# Altium schematic sheet Schematic.SchDoc: Muzzleflash Simulator V1
size A4; DrawnBy: Philipp Hergesell; Revision: V1.0; SheetNumber: 1; SheetTotal: 1
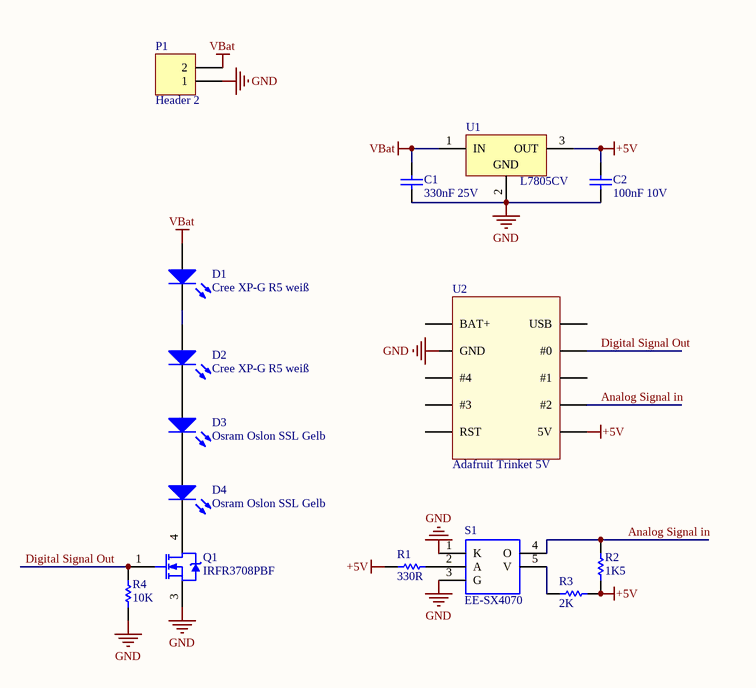
[diagram p0: Schematic.SchDoc]

## Parts
C1  330nF 25V  [CAPC0603(1608)100_M]
C2  100nF 10V  [CAPC0603(1608)100_L]
D1  Cree XP-G R5 weiß  [3.5X2.8X1.9]
D2  Cree XP-G R5 weiß  [3.5X2.8X1.9]
D3  Osram Oslon SSL Gelb  [3.5X2.8X1.9]
D4  Osram Oslon SSL Gelb  [3.5X2.8X1.9]
P1  Header 2  [HDR1X2]
Q1  IRFR3708PBF  [INTR-TO-252AA-3_M]
R1  330R  [RESC0603(1608)_L]
R2  1K5  [RESC0603(1608)_L]
R3  2K  [RESC0603(1608)_N]
R4  10K  [RESC0603(1608)_N]
S1  EE-SX4070  [EE-SX4070]
U1  L7805CV  [TO220]
U2  Adafruit Trinket 5V

## Nets
+5V: C2.2 R1.1 R2.1 R3.2 U1.3(OUT) U2.10(5V)
GND: C1.1 C2.1 P1.1 Q1.3(S) R4.1 S1.1(K) S1.3(G) U1.2(GND)
VBat: C1.2 D1.1(A) P1.2 U1.1(IN)
Analog Signal in: R2.2 S1.4(O) U2.9(#2)
Digital Signal Out: Q1.1(G) R4.2 U2.7(#0)
NetD1_2: D1.2(K) D2.1(A)
NetD2_2: D2.2(K) D3.1(A)
NetD3_2: D3.2(K) D4.1(A)
NetD4_2: D4.2(K) Q1.4(D)
NetR1_2: R1.2 S1.2(A)
NetR3_1: R3.1 S1.5(V)

Not connected (* = marked no-connect by the designer): U2 1(BAT+) 2(GND) 3(#4) 4(#3) 5(RST) 6(USB) 8(#1)

## Notes on the sheet
- Labels drawn without touching a wire or pin: GND

## Library data of the parts
C1 = CMP-1035-02676-1: CAP 330nF 25V -20% to +80% 0603 (1608 Metric) Thickness 1mm SMD; Case-EIA: 0603; Case-Metric: 1608; Max Thickness: 1 mm; Rated Voltage: 25 V; Tolerance: -20% to +80%; Value: 330nF; Technology: SMT
C2 = CMP-1035-02579-1: CAP 100nF 10V ±5% 0603 (1608 Metric) Thickness 1mm SMD; Tolerance: Â±5%; Case-EIA: 0603; Case-Metric: 1608; Value: 100nF; Max Thickness: 1 mm; Rated Voltage: 10 V; Technology: SMT
D1-D4 = LED3: Typical BLUE SiC LED; Published: 8-Jun-2000; LatestRevisionDate: 17-Dec-2003; LatestRevisionNote: PCB Footprint replaced.; DatasheetVersion: 16-Apr-2002; PackageVersion: 16-Apr-2002; PackageReference: 3.5X2.8X1.9; Publisher: Altium Limited; PackageDescription: SM LED; 2 C-Bend Leads; Body 3.5 x 2.8 x 1.9 mm, inc leads (LxWxH typ)
P1 = Header 2: Header, 2-Pin; LatestRevisionDate: 17-Jul-2002; LatestRevisionNote: Re-released for DXP Platform.; Publisher: Altium Limited
Q1 = CMP-2000-05156-1: Mosfet N-Channel, 30 V, 61 A, -55 to 175 degC, 3-Pin DPAK, RoHS, Tube; Manufacturer: International Rectifier; Voltage Vds Typ: 30V; Power Dissipation Pd: 87W; Rds(on) Test Voltage Vgs: 10V; Transistor Polarity: NChannel; Threshold Voltage Vgs Typ: 2V; Pulse Current Idm: 244A; Junction to Case Thermal Resistance A: 1.73degC/W; On Resistance Rds(on): 13mohm; No. of Pins: 3; Alternate Case Style: D-PAK; On State resistance @ Vgs = 10V: 12.5mohm; SVHC: NoSVHC(19-Dec-2012); Continuous Drain Current Id: 61A; Transistor Case Style: TO-252; Package Reference: TO-252AA-3; Drain Source Voltage Vds: 30V; Datasheet URL: http://www.irf.com/product-info/datasheets/data/irfr3708pbf.pdf; Voltage Vgs Rds on Measurement: 10V; Operating Temperature Min: -55degC; MSL: –; Manufacturer URL: http://internationalrectifier.com/; Voltage Vgs Max: 2V; Operating Temperature Range: -55degCto+175degC; Current Id Max: 61A; Operating Temperature Max: 175degC; Package / Case: DPAK; Package Description: 3-Pin Surface Mount Device, Body 6.54 x 6.095 mm, Pitch 2.29 mm; Datasheet Version: Dec-04
R1 = CMP-1012-00062-1: 330R 0.1W 5% 0603 (1608 Metric)  SMD; Value: 330.00 Ohm; Case-EIA: 0603; Case-Metric: 1608; Tolerance: 5 %; Power: 0.1 W; Technology: SMT
R2 = CMP-1012-00528-1: 1K5 0.1W 1% 0603 (1608 Metric)  SMD; Case-EIA: 0603; Value: 1500.00 Ohm; Case-Metric: 1608; Power: 0.1 W; Technology: SMT; Tolerance: 1 %
R3 = CMP-1012-00542-1: 2K 0.1W 1% 0603 (1608 Metric)  SMD; Case-EIA: 0603; Value: 2000.00 Ohm; Case-Metric: 1608; Power: 0.1 W; Technology: SMT; Tolerance: 1 %
R4 = CMP-1012-00623-1: 10K 0.1W 1% 0603 (1608 Metric)  SMD; Value: 10000.00 Ohm; Case-EIA: 0603; Case-Metric: 1608; Power: 0.1 W; Tolerance: 1 %; Technology: SMT
S1 = EE-SX4070: Slotted photo switch,EE-SX4070 8mm W Omron EE-SX4070 Through Hole Slotted Optical Switch; Manufacturer_Name: Omron Electronics; Allied_Number: 70175558; RS Part Number: 2192527; Manufacturer_Part_Number: EE-SX4070; Datasheet Link: http://uk.rs-online.com/web/p/products/2192527
U1 = CMP-0244-00483-1: Positive Voltage Regulator, 5V, 3-Pin TO-220; PackageDescription: TO, Thru-Hole, Vertical, Heatsink Mounted; 3 In-Line Leads; Pitch 2.54 mm; ComponentLink2Description: Datasheet; PackageReference: TO220; ComponentLink3URL: http://www.st.com/internet/com/TECHNICAL_RESOURCES/TECHNICAL_LITERATURE/PACKAGE_INFORMATION/CD00004649.pdf; DatasheetVersion: 16/11/2011; ComponentLink1Description: Manufacturer URL; ComponentLink1URL: http://www.st.com; PackageVersion: ver3.0; ComponentLink3Description: Package Specification; ComponentLink2URL: http://www.st.com/internet/com/TECHNICAL_RESOURCES/TECHNICAL_LITERATURE/DATASHEET/CD00000444.pdf